# Altium project Phaser_DIOT.PrjPCB (part 1 of 10)
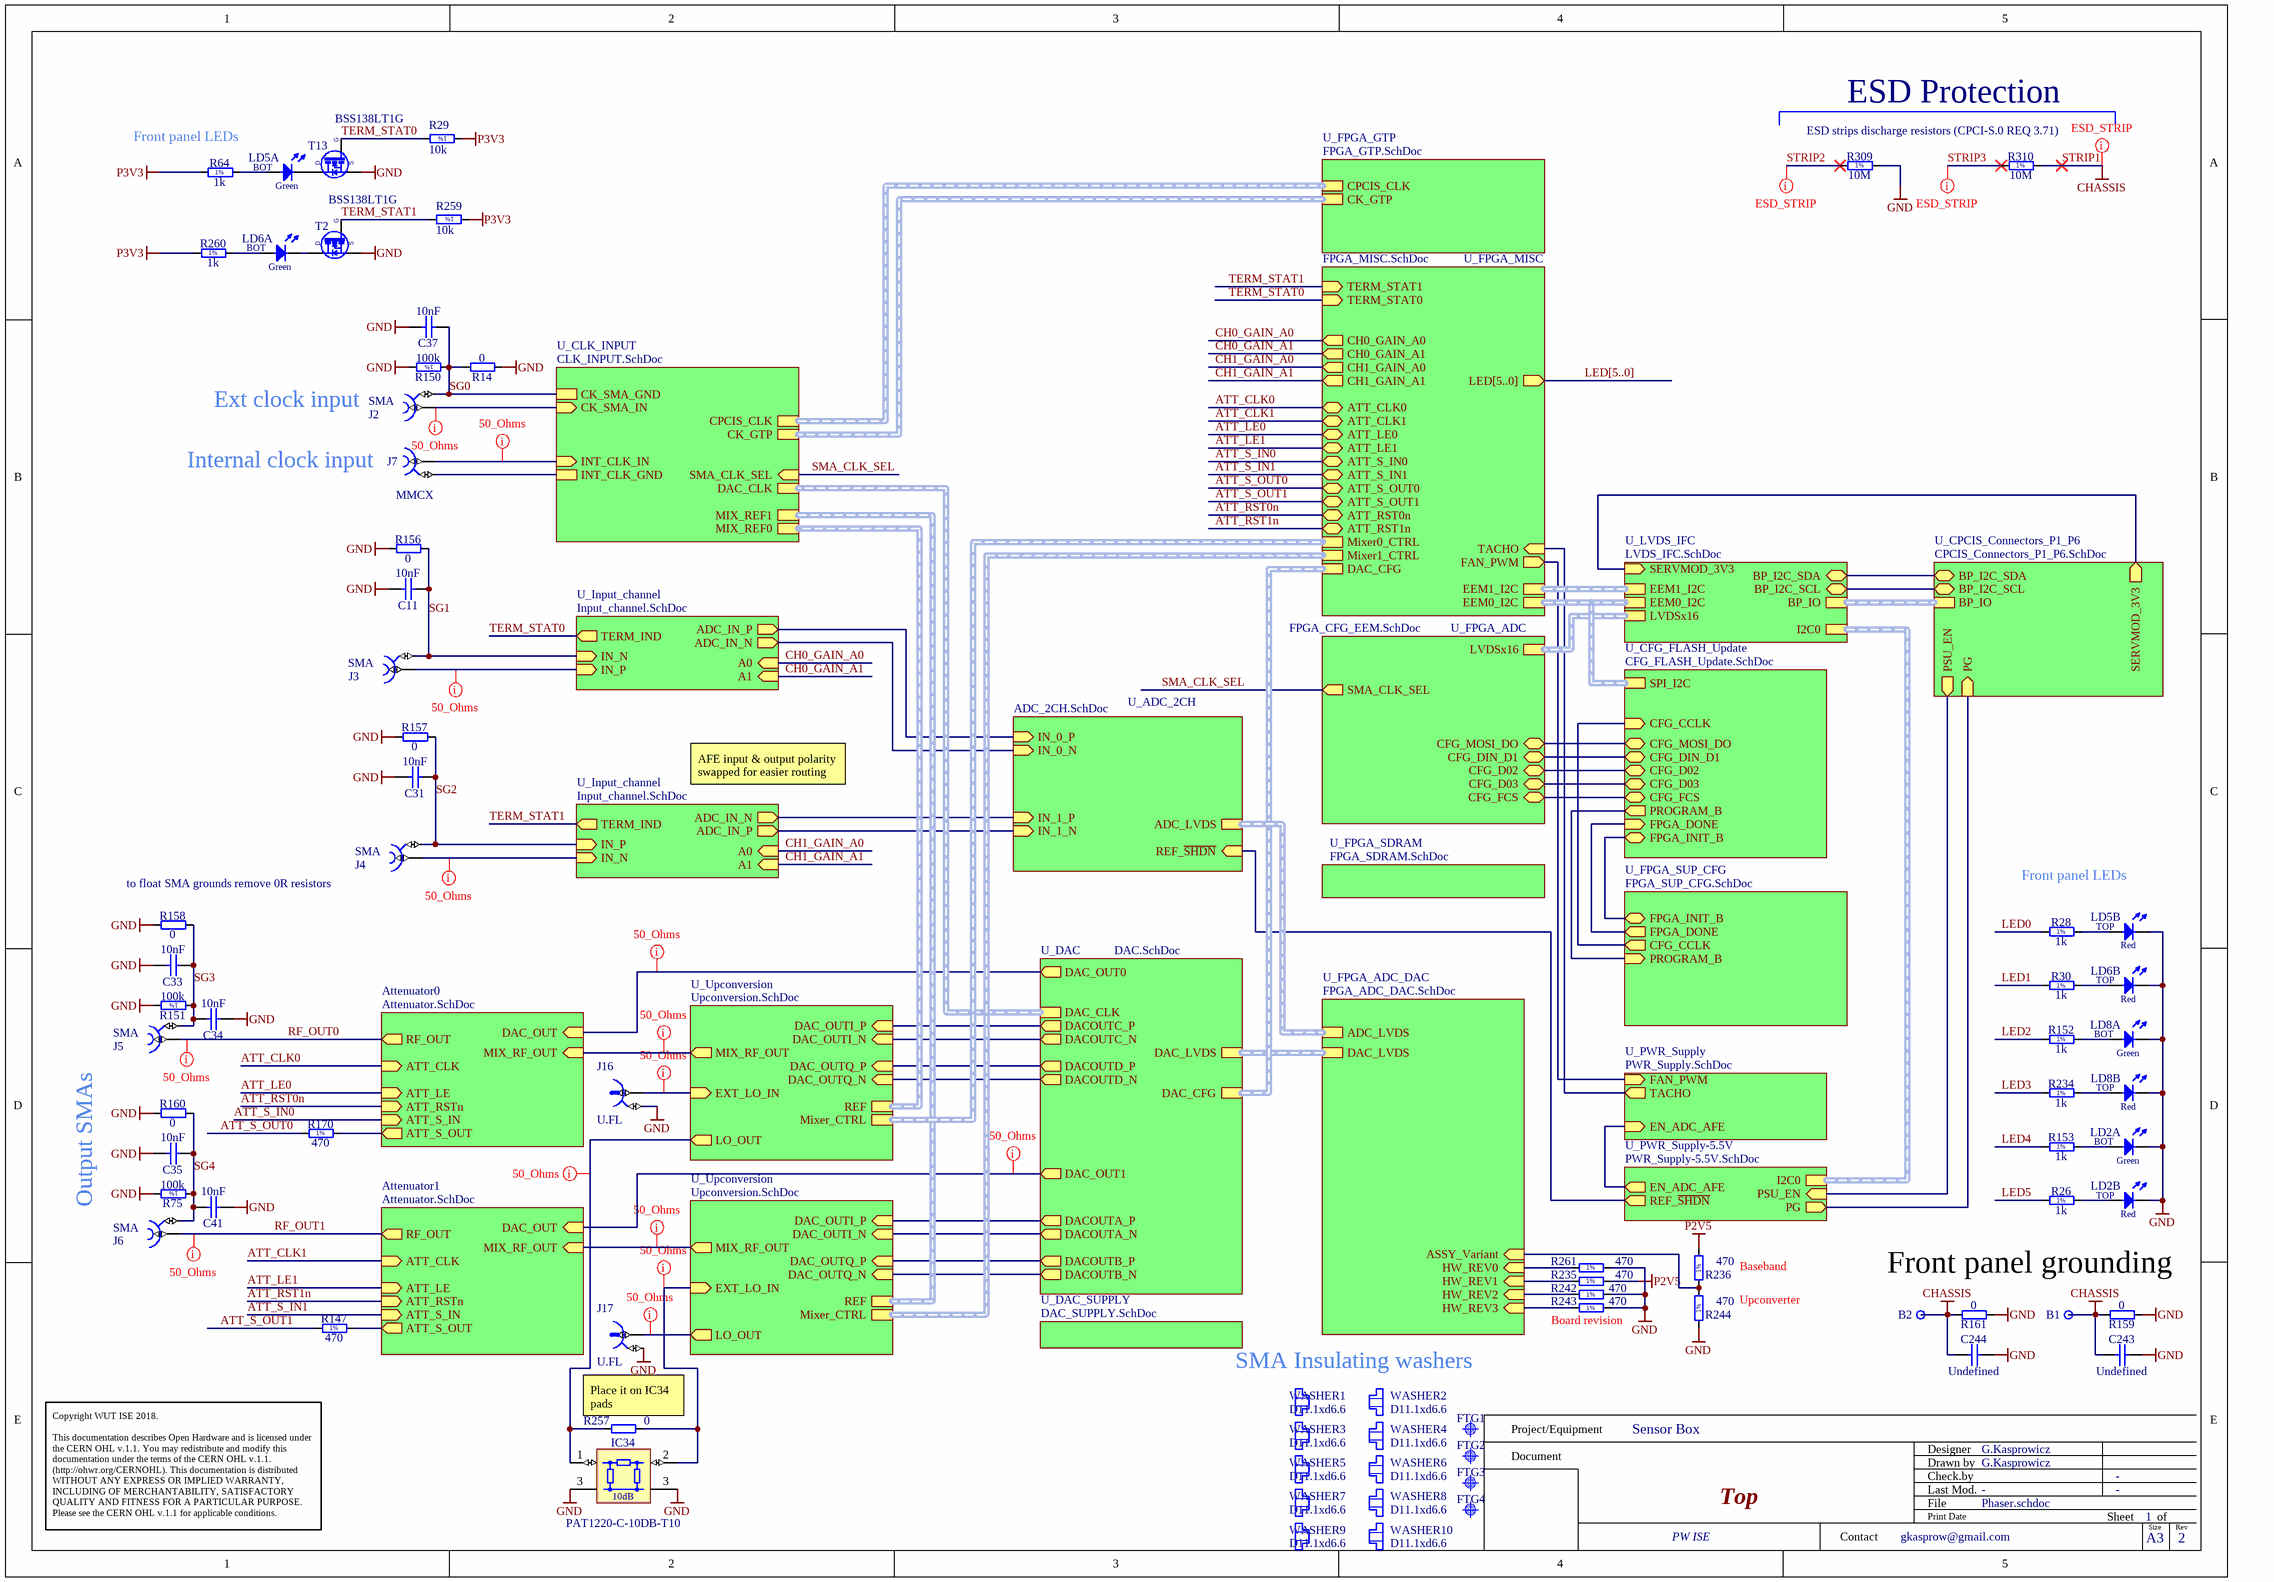
[diagram p0: Phaser.schdoc]
P_SheetTotal: 19; P_Title: Phaser_DIOT
19 sheets, 1099 parts. Net scope: hierarchical (ports join the sheet entries above them; power ports are global).
Board file: Phaser_DIOT.PcbDoc
Sheets:
  Phaser.schdoc
    Attenuator0 = Attenuator.SchDoc
    Attenuator1 = Attenuator.SchDoc
    U_FPGA_MISC = FPGA_MISC.SchDoc
    U_PWR_Supply = PWR_Supply.SchDoc
    U_CLK_INPUT = CLK_INPUT.SchDoc
    U_ADC_2CH = ADC_2CH.SchDoc
    U_Input_channel = Input_channel.SchDoc
    U_DAC = DAC.SchDoc
    U_FPGA_ADC = FPGA_CFG_EEM.SchDoc
    U_Input_channel = Input_channel.SchDoc
    U_FPGA_SUP_CFG = FPGA_SUP_CFG.SchDoc
    U_FPGA_GTP = FPGA_GTP.SchDoc
    U_FPGA_SDRAM = FPGA_SDRAM.SchDoc
    U_FPGA_ADC_DAC = FPGA_ADC_DAC.SchDoc
    U_CFG_FLASH_Update = CFG_FLASH_Update.SchDoc
    U_Upconversion = Upconversion.SchDoc
    U_Upconversion = Upconversion.SchDoc
    U_DAC_SUPPLY = DAC_SUPPLY.SchDoc
    U_LVDS_IFC = LVDS_IFC.SchDoc
    U_CPCIS_Connectors_P1_P6 = CPCIS_Connectors_P1_P6.SchDoc
    U_PWR_Supply-5.5V = PWR_Supply-5.5V.SchDoc

## Sheet Phaser.schdoc: =P_Title
size 420 x 297 mm; EDA_Number: ARTIQ; Projet: ARTIQ/SINARA; Author: G.Kasprowicz; CompanyName: WUT ISE; DrawnBy: G.Kasprowicz; Organization: WUT ISE; Address1: PW ISE; Address2: Nowowiejska 15/19 00-665 Warsaw; Address3: gkasprow@gmail.com; DocumentNumber: 1; Revision: 2; SheetNumber: 1; SheetTotal: 19; ModifiedBy: -; CheckedDate: -; Title2: Top; DivGrp: WUT ISE; Designer: G.Kasprowicz; ModifiedDate: -; ProjectName: Sensor Box

### Parts
B1  Plated Hole  [MTG270_500]  (value not drawn)
B2  Plated Hole  [MTG270_500]  (value not drawn)
C11  10nF  [CAPC1005X55N]
C31  10nF  [CAPC1005X55N]
C33  10nF  [CAPC1005X55N]
C34  10nF  [CAPC1005X55N]
C35  10nF  [CAPC1005X55N]
C37  10nF  [CAPC1005X55N]
C41  10nF  [CAPC1005X55N]
C243  Undefined  [CAPC2012X135N]
C244  Undefined  [CAPC2012X135N]
FTG1  Use only in PCB  [FIDUCIAL_TOP_C100-200]  (value not drawn)
FTG2  Use only in PCB  [FIDUCIAL_TOP_S100-200]  (value not drawn)
FTG3  Use only in PCB  [FIDUCIAL_TOP_S100-200]  (value not drawn)
FTG4  Use only in PCB  [FIDUCIAL_TOP_S100-200]  (value not drawn)
IC34  PAT1220-C-10DB-T10  [SUSUMU_PAT1220]
J2  SMA  [AMPHENOL_132203-14]
J3  SMA  [AMPHENOL_132203-14]
J4  SMA  [AMPHENOL_132203-14]
J5  SMA  [AMPHENOL_132203-14]
J6  SMA  [AMPHENOL_132203-14]
J7  MMCX  [SAMTEC_MMCX-J-P-H-ST-TH1]
J16  U.FL  [HIROSE_U.FL-R-SMT-1(10)]
J17  U.FL  [HIROSE_U.FL-R-SMT-1(10)]
LD2  Red/Green  [LED_DIALIGHT_571-0112F]  (value not drawn)  (parts A,B of 2)
LD5  Red/Green  [LED_DIALIGHT_571-0112F]  (value not drawn)  (parts A,B of 2)
LD6  Red/Green  [LED_DIALIGHT_571-0112F]  (value not drawn)  (parts A,B of 2)
LD8  Red/Green  [LED_DIALIGHT_571-0112F]  (value not drawn)  (parts A,B of 2)
R14  0  [RESC1608X55N]
R26  1k  [RESC1005X40N]
R28  1k  [RESC1005X40N]
R29  10k  [RESC1005X40N]
R30  1k  [RESC1005X40N]
R64  1k  [RESC1005X40N]
R75  100k  [RESC1005X40N]
R147  470  [RESC1005X40N]
R150  100k  [RESC1005X40N]
R151  100k  [RESC1005X40N]
R152  1k  [RESC1005X40N]
R153  1k  [RESC1005X40N]
R156  0  [RESC1608X55N]
R157  0  [RESC1608X55N]
R158  0  [RESC1608X55N]
R159  0  [RESC1608X55N]
R160  0  [RESC1608X55N]
R161  0  [RESC1608X55N]
R170  470  [RESC1005X40N]
R234  1k  [RESC1005X40N]
R235  470  [RESC1005X40N]
R236  470  [RESC1005X40N]
R242  470  [RESC1005X40N]
R243  470  [RESC1005X40N]
R244  470  [RESC1005X40N]
R257  0  [RESC1005X40N]
R259  10k  [RESC1005X40N]
R260  1k  [RESC1005X40N]
R261  470  [RESC1005X40N]
R309  10M  [RESC2113X55N]
R310  10M  [RESC2113X55N]
T2  BSS138LT1G  [SOT95P240X110-3N]
T13  BSS138LT1G  [SOT95P240X110-3N]
WASHER1  D11.1xd6.6  [Keystone_7687]
WASHER2  D11.1xd6.6  [Keystone_7687]
WASHER3  D11.1xd6.6  [Keystone_7687]
WASHER4  D11.1xd6.6  [Keystone_7687]
WASHER5  D11.1xd6.6  [Keystone_7687]
WASHER6  D11.1xd6.6  [Keystone_7687]
WASHER7  D11.1xd6.6  [Keystone_7687]
WASHER8  D11.1xd6.6  [Keystone_7687]
WASHER9  D11.1xd6.6  [Keystone_7687]
WASHER10  D11.1xd6.6  [Keystone_7687]

### Sub-sheets
Attenuator0 = Attenuator.SchDoc: RF_OUT (out), ATT_CLK (in), ATT_S_IN (in), ATT_LE (in), ATT_RSTn (in), ATT_S_OUT (out), DAC_OUT (in), MIX_RF_OUT (in)
Attenuator1 = Attenuator.SchDoc: RF_OUT (out), ATT_CLK (in), ATT_S_IN (in), ATT_LE (in), ATT_RSTn (in), ATT_S_OUT (out), DAC_OUT (in), MIX_RF_OUT (in)
U_ADC_2CH = ADC_2CH.SchDoc: REF_~{SHDN} (in), IN_0_P (in), IN_1_P (in), IN_0_N (in), IN_1_N (in), ADC_LVDS (harness ADC_LVDS)
U_CFG_FLASH_Update = CFG_FLASH_Update.SchDoc: SPI_I2C (harness I2C), CFG_MOSI_DO (bidir), CFG_DIN_D1 (bidir), CFG_D02 (bidir), CFG_D03 (bidir), CFG_FCS (bidir), CFG_CCLK (in), FPGA_DONE (in), FPGA_INIT_B (bidir), PROGRAM_B (out)
U_CLK_INPUT = CLK_INPUT.SchDoc: CK_SMA_IN (in), INT_CLK_IN (in), SMA_CLK_SEL (in), CK_GTP (harness CLKDIFF), MIX_REF0 (harness CLKDIFF), MIX_REF1 (harness CLKDIFF), DAC_CLK (harness CLKDIFF), CK_SMA_GND, INT_CLK_GND, CPCIS_CLK (harness CLKDIFF)
U_CPCIS_Connectors_P1_P6 = CPCIS_Connectors_P1_P6.SchDoc: SERVMOD_3V3 (out), PSU_EN (out), BP_I2C_SDA (bidir), BP_I2C_SCL (bidir), BP_IO (harness BP_IO), PG (in)
U_DAC = DAC.SchDoc: DAC_CFG (harness DAC_CFG), DAC_LVDS (harness DAC_LVDS), DAC_CLK (harness CLKDIFF), DAC_OUT0 (out), DAC_OUT1 (out), DACOUTD_P (out), DACOUTD_N (out), DACOUTC_N (out), DACOUTC_P (out), DACOUTA_P (out), DACOUTA_N (out), DACOUTB_N (out), DACOUTB_P (out)
U_DAC_SUPPLY = DAC_SUPPLY.SchDoc: no entries
U_FPGA_ADC = FPGA_CFG_EEM.SchDoc: CFG_DIN_D1 (bidir), CFG_FCS (bidir), CFG_MOSI_DO (bidir), CFG_D02 (bidir), CFG_D03 (bidir), SMA_CLK_SEL (out), LVDSx16
U_FPGA_ADC_DAC = FPGA_ADC_DAC.SchDoc: DAC_LVDS (harness DAC_LVDS), ADC_LVDS, ASSY_Variant (in), HW_REV1 (in), HW_REV2 (in), HW_REV0 (in), HW_REV3 (in)
U_FPGA_GTP = FPGA_GTP.SchDoc: CK_GTP (harness CLKDIFF), CPCIS_CLK
U_FPGA_MISC = FPGA_MISC.SchDoc: DAC_CFG (harness DAC_CFG), LED[5..0] (out), EEM1_I2C (harness I2C), EEM0_I2C (harness I2C), Mixer1_CTRL (harness Mixer_CTRL), Mixer0_CTRL (harness Mixer_CTRL), CH0_GAIN_A0 (out), CH0_GAIN_A1 (out), CH1_GAIN_A0 (out), CH1_GAIN_A1 (out), ATT_CLK0 (bidir), ATT_CLK1 (bidir), ATT_LE0 (bidir), ATT_LE1 (bidir), ATT_S_IN0 (bidir), ATT_S_OUT0 (bidir), ATT_S_IN1 (bidir), ATT_S_OUT1 (bidir), ATT_RST0n (bidir), ATT_RST1n (bidir), FAN_PWM (out), TERM_STAT1 (in), TERM_STAT0 (in), TACHO (in)
U_FPGA_SDRAM = FPGA_SDRAM.SchDoc: no entries
U_FPGA_SUP_CFG = FPGA_SUP_CFG.SchDoc: FPGA_INIT_B (bidir), FPGA_DONE (out), CFG_CCLK (out), PROGRAM_B (in)
U_Input_channel = Input_channel.SchDoc: IN_N (in), A0 (in), A1 (in), IN_P (in), ADC_IN_P (out), ADC_IN_N (out), TERM_IND (out)
U_Input_channel = Input_channel.SchDoc: IN_N (in), A0 (in), A1 (in), IN_P (in), ADC_IN_P (out), ADC_IN_N (out), TERM_IND (out)
U_LVDS_IFC = LVDS_IFC.SchDoc: I2C0 (harness I2C), EEM0_I2C (harness I2C), EEM1_I2C (harness I2C), LVDSx16 (harness LVDSx16), BP_IO (harness BP_IO), BP_I2C_SDA (bidir), BP_I2C_SCL (bidir), SERVMOD_3V3 (in)
U_PWR_Supply = PWR_Supply.SchDoc: EN_ADC_AFE (in), FAN_PWM (in), TACHO (out)
U_PWR_Supply-5.5V = PWR_Supply-5.5V.SchDoc: I2C0 (harness I2C), EN_ADC_AFE (out), REF_~{SHDN} (out), PSU_EN (in), PG (out)
U_Upconversion = Upconversion.SchDoc: DAC_OUTI_P (in), DAC_OUTI_N (in), DAC_OUTQ_N (in), DAC_OUTQ_P (in), REF (harness CLKDIFF), MIX_RF_OUT (out), Mixer_CTRL (harness Mixer_CTRL), EXT_LO_IN (in), LO_OUT (out)
U_Upconversion = Upconversion.SchDoc: DAC_OUTI_P (in), DAC_OUTI_N (in), DAC_OUTQ_N (in), DAC_OUTQ_P (in), REF (harness CLKDIFF), Mixer_CTRL (harness Mixer_CTRL), MIX_RF_OUT (out), EXT_LO_IN (in), LO_OUT (out)

### Nets
GND: C11.2 C31.2 C33.2 C34.1 C35.2 C37.2 C41.1 C243.2 C244.2 IC34.3(GND) J16.2 J17.2 LD2.1(C) LD2.3(C) LD5.3(C) LD6.3(C) LD8.1(C) LD8.3(C) R14.1 R75.1 R150.1 R151.1 R156.1 R157.1 R158.1 R159.1 R160.1 R161.1 R242.2 R243.2 R244.1 R261.2 R309.2 T2.2(S) T13.2(S)
P2V5: R235.2 R236.2
P3V3: R29.1 R64.1 R259.1 R260.1
STRIP1: B1.1 B2.1 C243.1 C244.1 R159.2 R161.2 R310.2  [also labelled CHASSIS]
ASSY_Variant: R236.1 R244.2 ; sheet U_FPGA_ADC_DAC/ASSY_Variant
ATT_CLK0: sheet Attenuator0/ATT_CLK, sheet U_FPGA_MISC/ATT_CLK0
ATT_CLK1: sheet Attenuator1/ATT_CLK, sheet U_FPGA_MISC/ATT_CLK1
ATT_LE0: sheet Attenuator0/ATT_LE, sheet U_FPGA_MISC/ATT_LE0
ATT_LE1: sheet Attenuator1/ATT_LE, sheet U_FPGA_MISC/ATT_LE1
ATT_RST0n: sheet Attenuator0/ATT_RSTn, sheet U_FPGA_MISC/ATT_RST0n
ATT_RST1n: sheet Attenuator1/ATT_RSTn, sheet U_FPGA_MISC/ATT_RST1n
ATT_S_IN0: sheet Attenuator0/ATT_S_IN, sheet U_FPGA_MISC/ATT_S_IN0
ATT_S_IN1: sheet Attenuator1/ATT_S_IN, sheet U_FPGA_MISC/ATT_S_IN1
ATT_S_OUT0: R170.1 ; sheet U_FPGA_MISC/ATT_S_OUT0
ATT_S_OUT1: R147.1 ; sheet U_FPGA_MISC/ATT_S_OUT1
BBI_N: sheet U_DAC/DACOUTA_N, sheet U_Upconversion/DAC_OUTI_N
BBI_N: sheet U_DAC/DACOUTC_N, sheet U_Upconversion/DAC_OUTI_N  [a separate net that carries the same name]
BBI_P: sheet U_DAC/DACOUTA_P, sheet U_Upconversion/DAC_OUTI_P
BBI_P: sheet U_DAC/DACOUTC_P, sheet U_Upconversion/DAC_OUTI_P  [a separate net that carries the same name]
BBQ_N: sheet U_DAC/DACOUTB_N, sheet U_Upconversion/DAC_OUTQ_N
BBQ_N: sheet U_DAC/DACOUTD_N, sheet U_Upconversion/DAC_OUTQ_N  [a separate net that carries the same name]
BBQ_P: sheet U_DAC/DACOUTB_P, sheet U_Upconversion/DAC_OUTQ_P
BBQ_P: sheet U_DAC/DACOUTD_P, sheet U_Upconversion/DAC_OUTQ_P  [a separate net that carries the same name]
BP_I2C_SCL: sheet U_LVDS_IFC/BP_I2C_SCL, sheet U_CPCIS_Connectors_P1_P6/BP_I2C_SCL
BP_I2C_SDA: sheet U_LVDS_IFC/BP_I2C_SDA, sheet U_CPCIS_Connectors_P1_P6/BP_I2C_SDA
CFG_CCLK: sheet U_FPGA_SUP_CFG/CFG_CCLK, sheet U_CFG_FLASH_Update/CFG_CCLK
CFG_D02: sheet U_FPGA_ADC/CFG_D02, sheet U_CFG_FLASH_Update/CFG_D02
CFG_D03: sheet U_FPGA_ADC/CFG_D03, sheet U_CFG_FLASH_Update/CFG_D03
CFG_DIN: sheet U_FPGA_ADC/CFG_DIN_D1, sheet U_CFG_FLASH_Update/CFG_DIN_D1
CFG_FCS: sheet U_FPGA_ADC/CFG_FCS, sheet U_CFG_FLASH_Update/CFG_FCS
CFG_MOSI: sheet U_FPGA_ADC/CFG_MOSI_DO, sheet U_CFG_FLASH_Update/CFG_MOSI_DO
CH0_GAIN_A0: sheet U_FPGA_MISC/CH0_GAIN_A0, sheet U_Input_channel/A0
CH0_GAIN_A1: sheet U_FPGA_MISC/CH0_GAIN_A1, sheet U_Input_channel/A1
CH1_GAIN_A0: sheet U_FPGA_MISC/CH1_GAIN_A0, sheet U_Input_channel/A0
CH1_GAIN_A1: sheet U_FPGA_MISC/CH1_GAIN_A1, sheet U_Input_channel/A1
FAN_PWM: sheet U_FPGA_MISC/FAN_PWM, sheet U_PWR_Supply/FAN_PWM
FAN_TACHO: sheet U_FPGA_MISC/TACHO, sheet U_PWR_Supply/TACHO
FPGA_DONE: sheet U_FPGA_SUP_CFG/FPGA_DONE, sheet U_CFG_FLASH_Update/FPGA_DONE
FPGA_INIT_B: sheet U_FPGA_SUP_CFG/FPGA_INIT_B, sheet U_CFG_FLASH_Update/FPGA_INIT_B
FPGA_PROGRAM_B: sheet U_FPGA_SUP_CFG/PROGRAM_B, sheet U_CFG_FLASH_Update/PROGRAM_B
HW_REV0: R261.1 ; sheet U_FPGA_ADC_DAC/HW_REV0
HW_REV1: R235.1 ; sheet U_FPGA_ADC_DAC/HW_REV1
HW_REV2: R242.1 ; sheet U_FPGA_ADC_DAC/HW_REV2
HW_REV3: R243.1 ; sheet U_FPGA_ADC_DAC/HW_REV3
IN_0_N: sheet U_ADC_2CH/IN_0_N, sheet U_Input_channel/ADC_IN_N
IN_0_P: sheet U_ADC_2CH/IN_0_P, sheet U_Input_channel/ADC_IN_P
IN_1_N: sheet U_ADC_2CH/IN_1_N, sheet U_Input_channel/ADC_IN_P
IN_1_P: sheet U_ADC_2CH/IN_1_P, sheet U_Input_channel/ADC_IN_N
LED0: R28.1
LED1: R30.1
LED2: R152.1
LED3: R234.1
LED4: R153.1
LED5: R26.1
PG: sheet U_CPCIS_Connectors_P1_P6/PG, sheet U_PWR_Supply-5.5V/PG
PSU_EN: sheet U_CPCIS_Connectors_P1_P6/PSU_EN, sheet U_PWR_Supply-5.5V/PSU_EN
RF_OUT0: J5.1 ; sheet Attenuator0/RF_OUT
RF_OUT1: J6.1 ; sheet Attenuator1/RF_OUT
SERVMOD_3V3: sheet U_LVDS_IFC/SERVMOD_3V3, sheet U_CPCIS_Connectors_P1_P6/SERVMOD_3V3
SG0: C37.1 J2.2 R14.2 R150.2 ; sheet U_CLK_INPUT/CK_SMA_GND
SG1: C11.1 J3.2 R156.2 ; sheet U_Input_channel/IN_N
SG2: C31.1 J4.2 R157.2 ; sheet U_Input_channel/IN_P
SG3: C33.1 C34.2 J5.2 R151.2 R158.2
SG4: C35.1 C41.2 J6.2 R75.2 R160.2
SMA_CLK_SEL: sheet U_CLK_INPUT/SMA_CLK_SEL, sheet U_FPGA_ADC/SMA_CLK_SEL
STRIP2: R309.1
STRIP3: R310.1
TERM_STAT0: R29.2 T13.1(G) ; sheet U_FPGA_MISC/TERM_STAT0, sheet U_Input_channel/TERM_IND
TERM_STAT1: R259.2 T2.1(G) ; sheet U_FPGA_MISC/TERM_STAT1, sheet U_Input_channel/TERM_IND
NetC133A_1: J16.1 ; sheet U_Upconversion/EXT_LO_IN
NetC133B_1: IC34.2(OUT) R257.1 ; sheet U_Upconversion/EXT_LO_IN
NetC190_1: J7.1 ; sheet U_CLK_INPUT/INT_CLK_IN
NetC196_1: J2.1 ; sheet U_CLK_INPUT/CK_SMA_IN
NetC270A_2: sheet Attenuator0/DAC_OUT, sheet U_DAC/DAC_OUT0
NetC270B_2: sheet Attenuator1/DAC_OUT, sheet U_DAC/DAC_OUT1
NetC354A_1: IC34.1(IN) R257.2 ; sheet U_Upconversion/LO_OUT
NetC354B_1: J17.1 ; sheet U_Upconversion/LO_OUT
NetC369A_1: sheet Attenuator0/MIX_RF_OUT, sheet U_Upconversion/MIX_RF_OUT
NetC369B_1: sheet Attenuator1/MIX_RF_OUT, sheet U_Upconversion/MIX_RF_OUT
NetIC3A_19: R170.2 ; sheet Attenuator0/ATT_S_OUT
NetIC3B_19: R147.2 ; sheet Attenuator1/ATT_S_OUT
NetIC7_3: sheet U_PWR_Supply/EN_ADC_AFE, sheet U_PWR_Supply-5.5V/EN_ADC_AFE
NetJ3_1: J3.1 ; sheet U_Input_channel/IN_P
NetJ4_1: J4.1 ; sheet U_Input_channel/IN_N
NetJ7_2: J7.2 ; sheet U_CLK_INPUT/INT_CLK_GND
NetLD2_2: LD2.2(A) R153.2
NetLD2_4: LD2.4(A) R26.2
NetLD5_1: LD5.1(C) T13.3(D)
NetLD5_2: LD5.2(A) R64.2
NetLD5_4: LD5.4(A) R28.2
NetLD6_1: LD6.1(C) T2.3(D)
NetLD6_2: LD6.2(A) R260.2
NetLD6_4: LD6.4(A) R30.2
NetLD8_2: LD8.2(A) R152.2
NetLD8_4: LD8.4(A) R234.2
NetR60_2: sheet U_ADC_2CH/REF_~{SHDN}, sheet U_PWR_Supply-5.5V/REF_~{SHDN}

### Buses and harness runs
bus LED[5..0] = sheet U_FPGA_MISC/LED[5..0]
harness sheet U_ADC_2CH/ADC_LVDS = sheet U_FPGA_ADC_DAC/ADC_LVDS
harness sheet U_CFG_FLASH_Update/SPI_I2C = sheet U_FPGA_MISC/EEM0_I2C = sheet U_LVDS_IFC/EEM0_I2C
harness sheet U_CLK_INPUT/CK_GTP = sheet U_FPGA_GTP/CK_GTP
harness sheet U_CLK_INPUT/CPCIS_CLK = sheet U_FPGA_GTP/CPCIS_CLK
harness sheet U_CLK_INPUT/DAC_CLK = sheet U_DAC/DAC_CLK
harness sheet U_CLK_INPUT/MIX_REF0 = sheet U_Upconversion/REF
harness sheet U_CLK_INPUT/MIX_REF1 = sheet U_Upconversion/REF
harness sheet U_CPCIS_Connectors_P1_P6/BP_IO = sheet U_LVDS_IFC/BP_IO
harness sheet U_DAC/DAC_CFG = sheet U_FPGA_MISC/DAC_CFG
harness sheet U_DAC/DAC_LVDS = sheet U_FPGA_ADC_DAC/DAC_LVDS
harness sheet U_FPGA_ADC/LVDSx16 = sheet U_LVDS_IFC/LVDSx16
harness sheet U_FPGA_MISC/EEM1_I2C = sheet U_LVDS_IFC/EEM1_I2C
harness sheet U_FPGA_MISC/Mixer0_CTRL = sheet U_Upconversion/Mixer_CTRL
harness sheet U_FPGA_MISC/Mixer1_CTRL = sheet U_Upconversion/Mixer_CTRL
harness sheet U_LVDS_IFC/I2C0 = sheet U_PWR_Supply-5.5V/I2C0

### Layout directives
net class 50_Ohms: NetC133A_1, NetC133B_1, NetC190_1, NetC196_1, NetC270A_2, NetC270B_2, NetC354A_1, NetC354B_1, NetC369A_1, NetC369B_1, NetJ3_1, NetJ4_1, RF_OUT0, RF_OUT1
net class ESD_STRIP: STRIP1, STRIP2, STRIP3

### Notes on the sheet
- ESD Protection
- Front panel LEDs
- ESD strips discharge resistors (CPCI-S.0 REQ 3.71)
- (near J2) Ext clock input
- (near J7) Internal clock input
- AFE input & output polarity swapped for easier routing
- to float SMA grounds remove 0R resistors
- Output SMAs
- (near R243) Board revision
- Baseband
- Upconverter
- Front panel grounding
- SMA Insulating washers
- (near R257) Place it on IC34 pads
- Project/Equipment
- Document
- Designer
- Drawn by
- Check.by
- Copyright WUT ISE 2018.
  This documentation describes Open Hardware and is licensed under the CERN OHL v.1.1. You may redistribute and modify this documentation under the terms of the CERN OHL v.1.1. (http://ohwr.org/CERNOHL). This documentation is distributed WITHOUT ANY EXPRESS OR IMPLIED WARRANTY, INCLUDING OF MERCHANTABILITY, SATISFACTORY QUALITY AND FITNESS FOR A PARTICULAR PURPOSE. Please see the CERN OHL v.1.1 for applicable conditions.
- Contact
- File
- Last Mod.
- Print Date
- Sheet
- Size
- A3
- of
- Rev
- (in symbol LED_DIALIGHT_571-0112F, part A) BOT; Green
- (in symbol LED_DIALIGHT_571-0112F, part B) TOP; Red
- (in symbol PAT1220-C-10DB-T10) 10dB
- (in symbol R0402_1K_1%_0.0625W_100PPM) 1%
- (in symbol R0402_10K_1%_0.0625W_100PPM) 1%
- (in symbol R0402_100K_1%_0.0625W_100PPM) 1%
- (in symbol R0402_470R_1%_0.0625W_100PPM) 1%
- (in symbol R0805_10M_1%_0.125W_100PPM_VISHAY_CRCW e3) 1%

### Library data of the parts
B1 B2 = PLATED_HOLE2.7_PAD5.0: Single Terminal Socket; Part Description: Plated Through Hole: Hole Dia.=2.7mm Pad Dia.=5.0mm; Mounted: No; Part Number: PLATED_HOLE2.7_PAD5.0; Component Kind: Standard (No BOM); Component Type: Standard (No BOM); Pin Count: 1; Family: Plated Hole; Socket: No; SMD: No; Sense: No; Status: None; ComponentHeight: 0mm; HelpURL: Undefined; Author: CERN DEM JMW; CreateDate: 27.09.2011; LatestRevisionDate: 27.09.2011; PackageDescription: Plated Through Hole: Hole Dia.=2.7mm Pad Dia.=5.0mm
C11 C31 C33-C35 C37 C41 = CC0402_10NF_16V_10%_X7R: Non-polarised capacitor; Part Description: SMD Multilayer Chip Ceramic Capacitor; Manufacturer: GENERIC; Manufacturer1 Part Number: 223878715636; Voltage: 16V; TC: X7R; Tolerance: ±10%; Part Number: CC0402_10NF_16V_10%_X7R; Component Kind: Standard; Component Type: Standard; Pin Count: 2; Value: 10nF; Status: Not Recommended; Manufacturer Part Number: CC0402_10NF_16V_10%_X7R; Case: 0402; Mounted: Yes; Socket: No; SMD: Yes; Sense: No; Manufacturer1 Example: PHYCOMP; Manufacturer1 ComponentHeight: 0.55mm; HelpURL: \\cern.ch\dfs\Applications\Altium\Datasheets\CC0402_X7R_PHYCOMP.pdf; Author: CERN DEM JLC; CreateDate: 2007-12-03; LatestRevisionDate: 2007-12-03
C243 C244 = CC0805_NO-VALUE: Non-polarised capacitor; Part Description: Reserved Footprint For 0805(2012) Chip Ceramic Capacitor; Mounted: No; Part Number: CC0805_NO-VALUE; Component Kind: Standard; Component Type: Standard; Pin Count: 2; Value: Undefined; Status: None; Manufacturer: Undefined; Manufacturer Part Number: CC0805_NO-VALUE; Case: 0805; Socket: No; SMD: Yes; Sense: No; Manufacturer1 ComponentHeight: 1.35mm; HelpURL: Undefined; Author: CERN DEM JLC; CreateDate: 10.12.2008; LatestRevisionDate: 11.09.2013
FTG1 = FIDUCIAL_TARGET_C100-200: Fiducial Target; Part Description: Round Fiducial Target, Top Layer, 1.0mm, Top Solder 2.0mm, Keepout =2.0mm; Mounted: No; Part Number: FIDUCIAL_TARGET_C100-200; Component Kind: Standard (No BOM); Component Type: Standard (No BOM); Pin Count: 1; Family: Fiducial; Socket: No; SMD: Yes; Sense: No; Status: None; ComponentHeight: 0mm; HelpURL: Undefined; Author: CERN DEM JLC; CreateDate: 09.02.2010; LatestRevisionDate: 04.04.2012; PackageDescription: Round Fiducial Target, Top Layer, 1.0mm, Top Solder 2.0mm, Keepout =2.0mm
FTG2-FTG4 = FIDUCIAL_TARGET_S100-200: Fiducial Target; Part Description: Square Fiducial Target, Top Layer, 1.0mm, Top Solder 2.0mm, Keepout =2.0mm; Mounted: No; Part Number: FIDUCIAL_TARGET_S100-200; Component Kind: Standard (No BOM); Component Type: Standard (No BOM); Pin Count: 1; Family: Fiducial; Socket: No; SMD: Yes; Sense: No; Status: None; ComponentHeight: 0mm; HelpURL: Undefined; Author: CERN DEM JLC; CreateDate: 09.02.2010; LatestRevisionDate: 04.04.2012; PackageDescription: Square Fiducial Target, Top Layer, 1.0mm, Top Solder 2.0mm, Keepout =2.0mm
IC34 = PAT1220-C-10DB-T10: DC to 10GHz, 100mW, 50 Ohm, 10dB, Precision Chip Attenuator; Manufacturer: SUSUMU; PressFit: No; Bonding: No; Part Number: PAT1220-C-10DB-T10; Component Kind: Standard; Component Type: Standard; Device: PAT1220-C-10DB-T10; PackageDescription: SUSUMU PAT1220, 4 Pin Attenuator, Size 0805, L 2.00 x W 1.25 H 0.5mm; Part Description: DC to 10GHz, 100mW, 50 Ohm, 10dB, Precision Chip Attenuator; Manufacturer Part Number: PAT1220-C-10DB-T10; Pin Count: 4; Mounted: Yes; Socket: No; SMD: Yes; Sense: No; ComponentHeight: 0.5mm; Author: CERN DEM MR; HelpURL: \\cern.ch\dfs\Applications\Altium\Datasheets\PAT1220-C-10DB-T10.pdf; CreateDate: 04.10.2017; LatestRevisionDate: 04.10.2017
J2-J6 = CON_SMA_AMP_132203-14: 50 Ohm Through Hole SMA Right Angle PCB Jack; Manufacturer: AMPHENOL; PressFit: No; Part Number: AMPHENOL_132203-14; Component Kind: Standard; Component Type: Standard; Pin Count: 5; Family: SMA; Mounted: Yes; Socket: No; SMD: No; Sense: No; Status: None; Part Description: 50 Ohm Through Hole SMA Right Angle PCB Jack; Manufacturer Part Number: 132203-14; ComponentHeight: 10.4mm; HelpURL: \\cern.ch\dfs\Applications\Altium\Datasheets\AMPHENOL_132203-16.pdf; Author: GK; CreateDate: 13.05.2019; LatestRevisionDate: 13.05.2019
J7 = SAMTEC_MMCX-J-P-H-ST-TH1: Part Description: Straight Through-hole 50 Ohm Micro Mini RF Jack, MMCX Series; Manufacturer: SAMTEC; PressFit: No; Part Number: SAMTEC_MMCX-J-P-H-ST-TH1; Component Kind: Standard; Component Type: Standard; Pin Count: 2; Mounted: Yes; Socket: No; Sense: No; SMD: No; Status: None; Manufacturer Part Number: MMCX-J-P-H-ST-TH1; ComponentHeight: 4.35mm; HelpURL: \\cern.ch\dfs\Applications\Altium\Datasheets\SAMTEC_MMCX-J-P-H-ST-TH1.pdf; Author: CERN DEM JLC; CreateDate: 05.12.2012; LatestRevisionDate: 05.12.2012
J16 J17 = HIROSE_U.FL-R-SMT-1(10): Part Description: Up to 6GHz Ultra Small Surface Mount Male Coaxial Connectors U.FL Series; Manufacturer: HIROSE (HRS); PressFit: No; Component Kind: Standard; Component Type: Standard; Pin Count: 2; Mounted: Yes; Socket: No; Sense: No; SMD: Yes; Status: None; Manufacturer Part Number: U.FL-R-SMT-1(10); ComponentHeight: 1.25mm; HelpURL: \\cern.ch\dfs\Applications\Altium\Datasheets\HIROSE_U.FL-R-SMT-1(10).pdf; Author: CERN DEM JLC; CreateDate: 24.03.2010; LatestRevisionDate: 24.03.2010; Part Number: HIROSE_U.FL-R-SMT-1(10); Family: U.FL
LD2 LD5 LD6 LD8 = LED_DIALIGHT_571-0112F: 2x LED  Botom Green, Top Red; Part Description: Dual 2mm  LEDs, Red Top,Green Bot, CBI® Circuit Board Indicator (Without positioning pins); PressFit: No; Bonding: No; Part Number: LED_DIALIGHT_571-0112F; Component Kind: Standard; Component Type: Standard; Color: Red/Green; PackageDescription: 2x 2mm LED (Top: Red, Bot: Green) PCB Edge Mounting (Without positioning pins) DIALIGHT 571 Serie; Manufacturer: DIALIGHT; Manufacturer Part Number: 571-0112F; Pin Count: 4; Mounted: Yes; Socket: No; SMD: No; Sense: No; ComponentHeight: 8.6mm; HelpURL: \\cern.ch\dfs\Applications\Altium\Datasheets\LED_DIALIGHT_571-0112F.pdf; Author: CERN DEM JLC; CreateDate: 09.11.2009; LatestRevisionDate: 17.03.2010
R14 R156-R161 = R0603_0R_JUMPER: Resistor; Part Description: 1A (0.05R Max DC Resistance) Zero Ohm Jumper; Manufacturer: GENERIC; Manufacturer1 Part Number: NRC06Z0; PressFit: No; Part Number: R0603_0R_JUMPER; Component Kind: Standard; Component Type: Standard; Pin Count: 2; Value: 0; Status: Preferred; Manufacturer Part Number: R0603_0R_JUMPER; Case: 0603; Mounted: Yes; Sense: No; Socket: No; SMD: Yes; Manufacturer1 Example: NIC COMPONENT; Manufacturer1 ComponentHeight: 0.55mm; HelpURL: \\cern.ch\dfs\Applications\Altium\Datasheets\R0603_NIC_NRC.pdf; Author: CERN DEM JLC; CreateDate: 03.12.2007; LatestRevisionDate: 13.03.2008
R26 R28 R30 R64 R152 R153 R234 R260 = R0402_1K_1%_0.0625W_100PPM: Resistor - 1%; Part Description: General Purpose Thick Film Chip Resistor; Manufacturer: GENERIC; Manufacturer1 Part Number: 232270671002L; TC: ±100ppm/°C; PressFit: No; Part Number: R0402_1K_1%_0.0625W_100PPM; Component Kind: Standard; Component Type: Standard; Pin Count: 2; Value: 1k; Status: Not Recommended; Power: 0.0625W; Tolerance: ±1%; Manufacturer Part Number: R0402_1K_1%_0.0625W_100PPM; Case: 0402; Mounted: Yes; Sense: No; Socket: No; SMD: Yes; Manufacturer1 Example: YAGEO PHYCOMP; Manufacturer1 ComponentHeight: 0.4mm; HelpURL: \\cern.ch\dfs\Applications\Altium\Datasheets\R0402_Phycomp_RC0402.pdf; Author: CERN DEM JLC; CreateDate: 03.12.2007; LatestRevisionDate: 17.10.2012
R29 R259 = R0402_10K_1%_0.0625W_100PPM: Resistor - 1%; Part Description: General Purpose Thick Film Chip Resistor; Manufacturer: GENERIC; Manufacturer1 Part Number: 232270671003L; TC: ±100ppm/°C; Part Number: R0402_10K_1%_0.0625W_100PPM; Component Kind: Standard; Component Type: Standard; Pin Count: 2; Value: 10k; Status: Not recommended; Power: 0.0625W; Tolerance: ±1%; Manufacturer Part Number: R0402_10K_1%_0.0625W_100PPM; Case: 0402; Mounted: Yes; Sense: No; Socket: No; SMD: Yes; Manufacturer1 Example: YAGEO PHYCOMP; Manufacturer1 ComponentHeight: 0.4mm; HelpURL: \\cern.ch\dfs\Applications\Altium\Datasheets\R0402_Phycomp_RC0402.pdf; Author: CERN DEM JLC; CreateDate: 03.12.2007; LatestRevisionDate: 17.10.2012
R75 R150 R151 = R0402_100K_1%_0.0625W_100PPM: Resistor - 1%; Part Description: General Purpose Thick Film Chip Resistor; Manufacturer: GENERIC; Manufacturer1 Part Number: 232270671004L; PressFit: No; TC: ±100ppm/°C; Part Number: R0402_100K_1%_0.0625W_100PPM; Component Kind: Standard; Component Type: Standard; Pin Count: 2; Value: 100k; Status: Not Recommended; Manufacturer Part Number: R0402_100K_1%_0.0625W_100PPM; Case: 0402; Mounted: Yes; Sense: No; Socket: No; SMD: Yes; Manufacturer1 Example: YAGEO PHYCOMP; Manufacturer1 ComponentHeight: 0.4mm; HelpURL: \\cern.ch\dfs\Applications\Altium\Datasheets\R0402_Phycomp_RC0402.pdf; Author: CERN DEM JLC; CreateDate: 03.12.2007; LatestRevisionDate: 17.10.2012; Power: 0.0625W; Tolerance: ±1%
R147 R170 R235 R236 R242-R244 R261 = R0402_470R_1%_0.0625W_100PPM: Resistor - 1%; Part Description: General Purpose Thick Film Chip Resistor; Manufacturer: GENERIC; Manufacturer1 Part Number: 232270674701L; TC: ±100ppm/°C; PressFit: No; Part Number: R0402_470R_1%_0.0625W_100PPM; Component Kind: Standard; Component Type: Standard; Pin Count: 2; Value: 470; Status: Not Recommended; Power: 0.0625W; Tolerance: ±1%; Manufacturer Part Number: R0402_470R_1%_0.0625W_100PPM; Case: 0402; Mounted: Yes; Sense: No; Socket: No; SMD: Yes; Manufacturer1 Example: YAGEO PHYCOMP; Manufacturer1 ComponentHeight: 0.4mm; HelpURL: \\cern.ch\dfs\Applications\Altium\Datasheets\R0402_Phycomp_RC0402.pdf; Author: CERN DEM JLC; CreateDate: 03.12.2007; LatestRevisionDate: 17.10.2012
R257 = R0402_0R_JUMPER: Resistor; Part Description: 1A (0.05R Max DC Resistance) Zero Ohm Jumper; Manufacturer: GENERIC; Manufacturer1 Part Number: 232270591001L; Part Number: R0402_0R_JUMPER; Component Kind: Standard; Component Type: Standard; Pin Count: 2; Value: 0; Status: Not recommended; Manufacturer Part Number: R0402_0R_JUMPER; Case: 0402; Mounted: Yes; Sense: No; Socket: No; SMD: Yes; Manufacturer1 Example: YAGEO PHYCOMP; Manufacturer1 ComponentHeight: 0.4mm; HelpURL: \\cern.ch\dfs\Applications\Altium\Datasheets\R0402_Phycomp_RC0402.pdf; Author: CERN DEM JLC; CreateDate: 2007-12-03; LatestRevisionDate: 2012-10-17
R309 R310 = R0805_10M_1%_0.125W_100PPM_VISHAY_CRCW e3: Resistor - 1%; Part Description: 150V, Standard Thick Film Chip Resistor; Manufacturer: VISHAY DALE; Manufacturer Part Number: CRCW080510M0FKEA; Power: 0.125W; TC: ±100ppm/°C; PressFit: No; Part Number: R0805_10M_1%_0.125W_100PPM_VISHAY_CRCW e3; Component Kind: Standard; Component Type: Standard; Pin Count: 2; Value: 10M; Status: None; Tolerance: ±1%; Case: 0805; Mounted: Yes; Sense: No; Socket: No; SMD: Yes; ComponentHeight: 0.5mm; HelpURL: \\cern.ch\dfs\Applications\Altium\Datasheets\R0805_VISHAY_CRCW e3.pdf; Author: CERN DEM BC; CreateDate: 2019-11-12; LatestRevisionDate: 2019-11-12
T2 T13 = BSS138LT1G: N-CHANNEL MOSFET WITH DIODE; Part Description: 50V 200mA N-Channel Enhancement Mode Field-Effect Transistor; Manufacturer: ON SEMICONDUCTOR; PressFit: No; Bonding: No; Part Number: BSS138LT1G; Component Kind: Standard; Component Type: Standard; Device: BSS138LT1G; PackageDescription: SOT23 3-Leads, Pitch 0.95mm - Body 1.4x3mm, IPC Medium Density; Manufacturer Part Number: BSS138LT1G; Pin Count: 3; Case: SOT23-3; Mounted: Yes; Socket: No; SMD: Yes; Sense: No; ComponentHeight: 1.11mm; HelpURL: \\cern.ch\dfs\Applications\Altium\Datasheets\BSS138LT1G.pdf; Author: CERN DEM JLC; CreateDate: 23.03.2009; LatestRevisionDate: 23.03.2009
WASHER1-WASHER10 = Keystone_7687: SMA_Shoulder Washer; Part Number: custom 3D; Part Description: Polyphenylene Sulfide PPS Shoulder Washer; PressFit: No; Component Kind: Standard; Component Type: Mechanical; Footprint: custom 3D; Pin Count: 0; PackageDescription: Polyphenylene Sulfide PPS Shoulder Washer; Mounted: Yes; Socket: No; SMD: No; Sense: No; Status: None; Value: D11.1xd6.6; Manufacturer: custom 3D; Manufacturer Part Number: custom 3D; ComponentHeight: 1.91mm; HelpURL: \\cern.ch\dfs\Applications\Altium\Datasheets\AAVID-THERMALLOY_7721-7PPSG.pdf; Author: GK; CreateDate: 28.01.2016; LatestRevisionDate: 28.01.2016

## Sheet Attenuator.SchDoc: =P_Title
size 420 x 297 mm; EDA_Number: ARTIQ; Projet: ARTIQ/SINARA; Author: G.Kasprowicz; CompanyName: WUT ISE; DrawnBy: G.Kasprowicz; Organization: WUT ISE; Address1: PW ISE; Address2: Nowowiejska 15/19 00-665 Warsaw; Address3: gkasprow@gmail.com; DocumentNumber: 10; Revision: 2; SheetNumber: 10; SheetTotal: 19; ModifiedBy: -; CheckedDate: -; Title2: Attenuator; DivGrp: WUT ISE; Designer: G.Kasprowicz; ModifiedDate: -; ProjectName: Sensor Box
Used 2 times, as channels Attenuator0, Attenuator1. Parts and nets are listed once, with the designators drawn on the sheet.
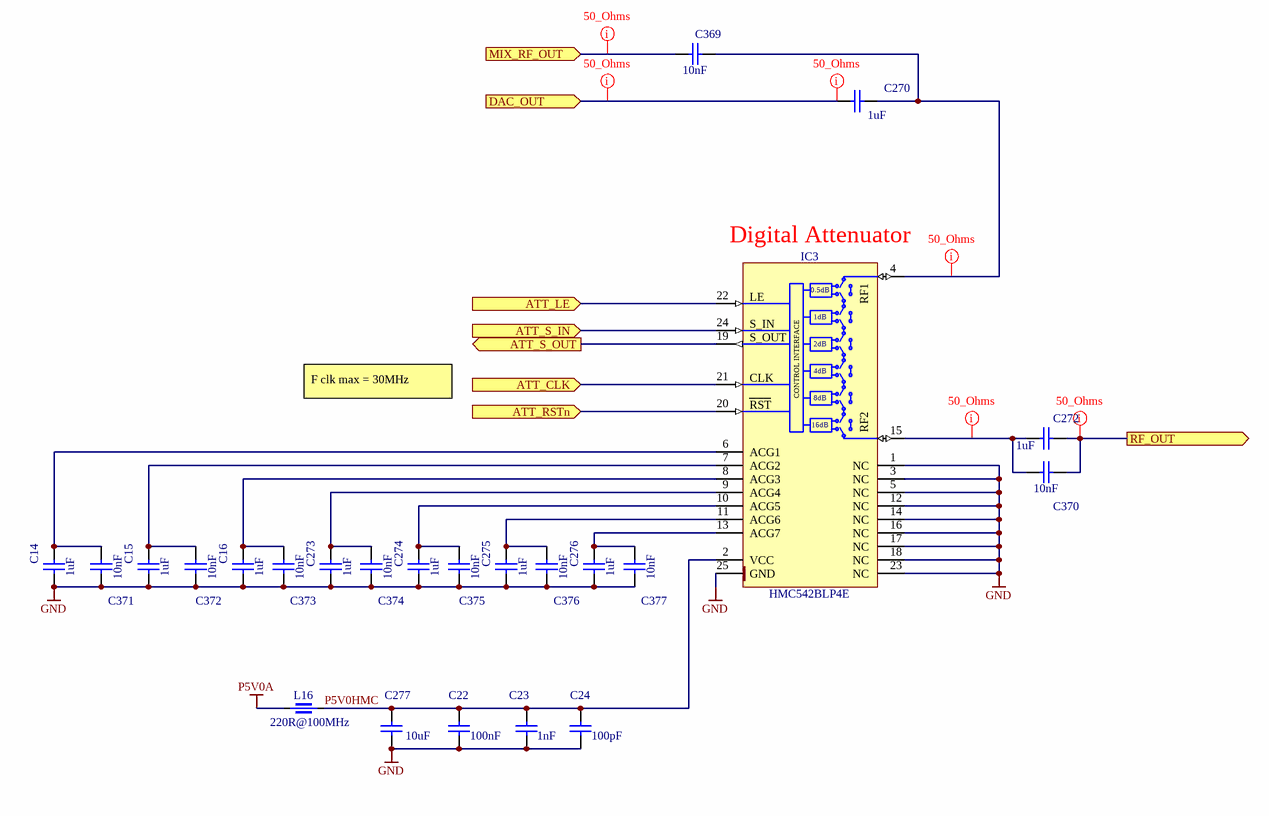
[diagram p1: Attenuator.SchDoc]

### Parts
C14  1uF  [CAPC1005X55N]
C15  1uF  [CAPC1005X55N]
C16  1uF  [CAPC1005X55N]
C22  100nF  [CAPC1005X55N]
C23  1nF  [CAPC1005X55N]
C24  100pF  [CAPC1005X55N]
C270  1uF  [CAPC1005X55N]
C272  1uF  [CAPC1005X55N]
C273  1uF  [CAPC1005X55N]
C274  1uF  [CAPC1005X55N]
C275  1uF  [CAPC1005X55N]
C276  1uF  [CAPC1005X55N]
C277  10uF  [CAPC1608X80N]
C369  10nF  [CAPC1005X55N]
C370  10nF  [CAPC1005X55N]
C371  10nF  [CAPC1005X55N]
C372  10nF  [CAPC1005X55N]
C373  10nF  [CAPC1005X55N]
C374  10nF  [CAPC1005X55N]
C375  10nF  [CAPC1005X55N]
C376  10nF  [CAPC1005X55N]
C377  10nF  [CAPC1005X55N]
IC3  HMC542BLP4E  [QFN50P400X400X100-25N-S295]
L16  220R@100MHz  [INDC1608X95N]

### Ports
ATT_CLK (in), ATT_LE (in), ATT_RSTn (in), ATT_S_IN (in), ATT_S_OUT (out), DAC_OUT (in), MIX_RF_OUT (in), RF_OUT (out)

### Nets
GND: C14.1 C15.1 C16.1 C22.1 C23.1 C24.1 C273.1 C274.1 C275.1 C276.1 C277.1 C371.1 C372.1 C373.1 C374.1 C375.1 C376.1 C377.1 IC3.1(NC) IC3.3(NC) IC3.5(NC) IC3.12(NC) IC3.14(NC) IC3.16(NC) IC3.17(NC) IC3.18(NC) IC3.23(NC) IC3.25(GND)
P5V0A: L16.1
ATT_CLK: IC3.21(SHIFT_CLOCK) ; port ATT_CLK
ATT_LE: IC3.22(LATCH_ENABLE) ; port ATT_LE
ATT_RSTn: IC3.20(~{RESET}) ; port ATT_RSTn
ATT_S_IN: IC3.24(SERIAL_INPUT) ; port ATT_S_IN
ATT_S_OUT: IC3.19(SERIAL_OUTPUT) ; port ATT_S_OUT
DAC_OUT: C270.2 ; port DAC_OUT
MIX_RF_OUT: C369.1 ; port MIX_RF_OUT
P5V0HMC: C22.2 C23.2 C24.2 C277.2 IC3.2(VCC) L16.2
RF_OUT: C272.1 C370.2 ; port RF_OUT
NetC14_2: C14.2 C371.2 IC3.6(ACG1)
NetC15_2: C15.2 C372.2 IC3.7(ACG2)
NetC16_2: C16.2 C373.2 IC3.8(ACG3)
NetC270_1: C270.1 C369.2 IC3.4(RF1)
NetC272_2: C272.2 C370.1 IC3.15(RF2)
NetC273_2: C273.2 C374.2 IC3.9(ACG4)
NetC274_2: C274.2 C375.2 IC3.10(ACG5)
NetC275_2: C275.2 C376.2 IC3.11(ACG6)
NetC276_2: C276.2 C377.2 IC3.13(ACG7)

### Channels
Attenuator0: designators end in A; ports ATT_CLK=ATT_CLK0 ATT_LE=ATT_LE0 ATT_RSTn=ATT_RST0n ATT_S_IN=ATT_S_IN0 ATT_S_OUT=NetIC3A_19 DAC_OUT=NetC270A_2 MIX_RF_OUT=NetC369A_1 RF_OUT=RF_OUT0
Attenuator1: designators end in B; ports ATT_CLK=ATT_CLK1 ATT_LE=ATT_LE1 ATT_RSTn=ATT_RST1n ATT_S_IN=ATT_S_IN1 ATT_S_OUT=NetIC3B_19 DAC_OUT=NetC270B_2 MIX_RF_OUT=NetC369B_1 RF_OUT=RF_OUT1

### Layout directives
net class 50_Ohms: NetC270A_1, NetC270A_2, NetC272A_2, NetC369A_1, RF_OUT0

### Notes on the sheet
- (near IC3) Digital Attenuator
- F clk max = 30MHz
- Project/Equipment
- Document
- Designer
- Drawn by
- Check.by
- Copyright WUT ISE 2018.
  This documentation describes Open Hardware and is licensed under the CERN OHL v.1.1. You may redistribute and modify this documentation under the terms of the CERN OHL v.1.1. (http://ohwr.org/CERNOHL). This documentation is distributed WITHOUT ANY EXPRESS OR IMPLIED WARRANTY, INCLUDING OF MERCHANTABILITY, SATISFACTORY QUALITY AND FITNESS FOR A PARTICULAR PURPOSE. Please see the CERN OHL v.1.1 for applicable conditions.
- Contact
- File
- Last Mod.
- Print Date
- Sheet
- Size
- A3
- of
- Rev
- (in symbol HMC542BLP4E) 0.5dB; LE; 1dB; S_IN; S_OUT; 2dB; CONTROL INTERFACE; 4dB; CLK; 8dB; RST; 16dB

### Library data of the parts
C14-C16 C270 C272-C276 = CC0402_1UF_16V_10%_X5R: Non-polarised capacitor; Part Description: SMD Multilayer Chip Ceramic Capacitor; Manufacturer: GENERIC; Manufacturer1 Part Number: C1005X5R1C105KT; Voltage: 16V; TC: X5R; Tolerance: ±10%; Part Number: CC0402_1UF_16V_10%_X5R; Component Kind: Standard; Component Type: Standard; Pin Count: 2; Value: 1uF; Status: Preferred; Manufacturer Part Number: CC0402_1UF_16V_10%_X5R; Case: 0402; Mounted: Yes; Socket: No; SMD: Yes; Sense: No; Manufacturer1 Example: TDK; Manufacturer1 ComponentHeight: 0.55mm; HelpURL: \\cern.ch\dfs\Applications\Altium\Datasheets\CC0402_X5R_TDK_C.pdf; Author: CERN DEM JLC; CreateDate: 25.10.2012; LatestRevisionDate: 25.10.2012
C22 = CC0402_100NF_16V_10%_X7R: Non-polarised capacitor; Part Description: SMD Multilayer Chip Ceramic Capacitor; Manufacturer: GENERIC; Manufacturer1 Part Number: GRM155R71C104KA88D; Voltage: 16V; TC: X7R; Tolerance: ±10%; Part Number: CC0402_100NF_16V_10%_X7R; Component Kind: Standard; Component Type: Standard; Pin Count: 2; Value: 100nF; Status: Not Recommended; Manufacturer Part Number: CC0402_100NF_16V_10%_X7R; Case: 0402; Mounted: Yes; Socket: No; SMD: Yes; Sense: No; Manufacturer1 Example: MURATA; Manufacturer1 ComponentHeight: 0.55mm; HelpURL: \\cern.ch\dfs\Applications\Altium\Datasheets\CC0402_X7R_MURATA_GRM.pdf; Author: CERN DEM JLC; CreateDate: 2013-12-05; LatestRevisionDate: 2007-12-03
C23 = CC0402_1NF_50V_10%_X7R: Non-polarised capacitor; Part Description: SMD Multilayer Chip Ceramic Capacitor; Manufacturer: GENERIC; Manufacturer1 Part Number: 223858715623; Voltage: 50V; TC: X7R; Tolerance: ±10%; Part Number: CC0402_1NF_50V_10%_X7R; Component Kind: Standard; Component Type: Standard; Pin Count: 2; Value: 1nF; Status: Not Recommended; Manufacturer Part Number: CC0402_1NF_50V_10%_X7R; Case: 0402; Mounted: Yes; Socket: No; SMD: Yes; Sense: No; Manufacturer1 Example: PHYCOMP; Manufacturer1 ComponentHeight: 0.55mm; HelpURL: \\cern.ch\dfs\Applications\Altium\Datasheets\CC0402_X7R_PHYCOMP.pdf; Author: CERN DEM JLC; CreateDate: 2007-12-03; LatestRevisionDate: 2007-12-03
C24 = CC0402_100PF_50V_5%_C0G: Non-polarised capacitor; Part Description: SMD Multilayer Chip Ceramic Capacitor; Manufacturer: GENERIC; Manufacturer1 Part Number: C0402C101J5GACTU; Voltage: 50V; TC: C0G/NP0; Tolerance: ±5%; Part Number: CC0402_100PF_50V_5%_C0G; Component Kind: Standard; Component Type: Standard; Pin Count: 2; Value: 100pF; Status: Preferred; Manufacturer Part Number: CC0402_100PF_50V_5%_C0G; Case: 0402; Mounted: Yes; Socket: No; SMD: Yes; Sense: No; Manufacturer1 Example: KEMET; Manufacturer1 ComponentHeight: 0.55mm; HelpURL: \\cern.ch\dfs\Applications\Altium\Datasheets\CC0805_C0G_KEMET_(Commercial Grade).pdf; Author: CERN DEM JLC; CreateDate: 2007-12-03; LatestRevisionDate: 2015-04-22
C277 = CC0603_10UF_16V_20%_X5R: Non-polarised capacitor; Part Description: SMD Multilayer Chip Ceramic Capacitor; Manufacturer: GENERIC; Manufacturer1 Part Number: GRM188R61C106MA73D; Voltage: 16V; TC: X5R; Tolerance: ±20%; Part Number: CC0603_10UF_16V_20%_X5R; Component Kind: Standard; Component Type: Standard; Pin Count: 2; Value: 10uF; Status: None; Manufacturer Part Number: CC0603_10UF_16V_20%_X5R; Case: 0603; Mounted: Yes; Socket: No; SMD: Yes; Sense: No; Manufacturer1 Example: MURATA; Manufacturer1 ComponentHeight: 0.8mm; HelpURL: \\cern.ch\dfs\Applications\Altium\Datasheets\CC0603_X5R_MURATA_GRM.pdf; Author: CERN DEM MR; CreateDate: 2016-03-02; LatestRevisionDate: 2016-03-02
C369-C377 = CC0402_10NF_25V_10%_X7R: Non-polarised capacitor; Part Description: SMD Multilayer Chip Ceramic Capacitor; Manufacturer: GENERIC; Manufacturer1 Part Number: C1005X7R1E103KT; Voltage: 25V; TC: X7R; Tolerance: ±10%; Part Number: CC0402_10NF_25V_10%_X7R; Component Kind: Standard; Component Type: Standard; Pin Count: 2; Value: 10nF; Status: Preferred; Manufacturer Part Number: CC0402_10NF_25V_10%_X7R; Case: 0402; Mounted: Yes; Socket: No; SMD: Yes; Sense: No; Manufacturer1 Example: TDK; Manufacturer1 ComponentHeight: 0.55mm; HelpURL: \\cern.ch\dfs\Applications\Altium\Datasheets\CC0402_X7R_TDK_C.pdf; Author: CERN DEM JLC; CreateDate: 25.10.2012; LatestRevisionDate: 25.10.2012
IC3 = HMC542BLP4E: 0.5dB LSB GaAs MMIC 6-bit Digital Serial Control Attenuator, DC - 4GHz; Part Description: 0.5dB LSB GaAs MMIC 6-bit Digital Serial Control Attenuator, DC to 4GHz; Manufacturer: HITTITE MICROWAVE CORP; PressFit: No; Bonding: No; Part Number: HMC542BLP4E; Component Kind: Standard; Component Type: Standard; Device: HMC542BLP4E; PackageDescription: QFN, 0.50mm Pitch, Square; 24 Pin, 4.00mm L X 4.00mm W X 1.00mm H Body (w/thermal Tab 2.95 X 2.95mm), IPC Medium Density; Manufacturer Part Number: HMC542BLP4E; Pin Count: 25; Case: QFN24; Mounted: Yes; Socket: No; SMD: Yes; Sense: No; ComponentHeight: 1mm; Author: CERN DEM JMW; HelpURL: \\cern.ch\dfs\Applications\Altium\Datasheets\HMC542BLP4E.pdf; CreateDate: 2016-08-17; LatestRevisionDate: 2016-08-17
L16 = IND0603_MURATA_BLM18SG221TN1: Part Description: SMD EMIFIL Suppression Chip Ferrite Bead; Manufacturer: MURATA; Power: 2.5A; Resistance: 0.04R; Tolerance: ±25%; Part Number: IND0603_MURATA_BLM18SG221TN1; Component Kind: Standard; Component Type: Standard; Pin Count: 2; Value: 220R@100MHz; Status: None; Manufacturer Part Number: BLM18SG221TN1; Case: 0603; Mounted: Yes; Socket: No; SMD: Yes; Sense: No; ComponentHeight: 0.95mm; HelpURL: \\cern.ch\dfs\Applications\Altium\Datasheets\IND0603_MURATA_BLM18S.pdf; Author: CERN DEM MR; CreateDate: 08.01.2016; LatestRevisionDate: 25.10.2018

## Sheet FPGA_MISC.SchDoc: =P_Title
size 420 x 297 mm; EDA_Number: ARTIQ; Projet: ARTIQ/SINARA; Author: G.Kasprowicz; CompanyName: WUT ISE; DrawnBy: G.Kasprowicz; Organization: WUT ISE; Address1: PW ISE; Address2: Nowowiejska 15/19 00-665 Warsaw; Address3: gkasprow@gmail.com; DocumentNumber: 18; Revision: 2; SheetNumber: 18; SheetTotal: 19; ModifiedBy: -; CheckedDate: -; Title2: FPGA MISC; DivGrp: WUT ISE; Designer: G.Kasprowicz; ModifiedDate: -; ProjectName: Sensor Box
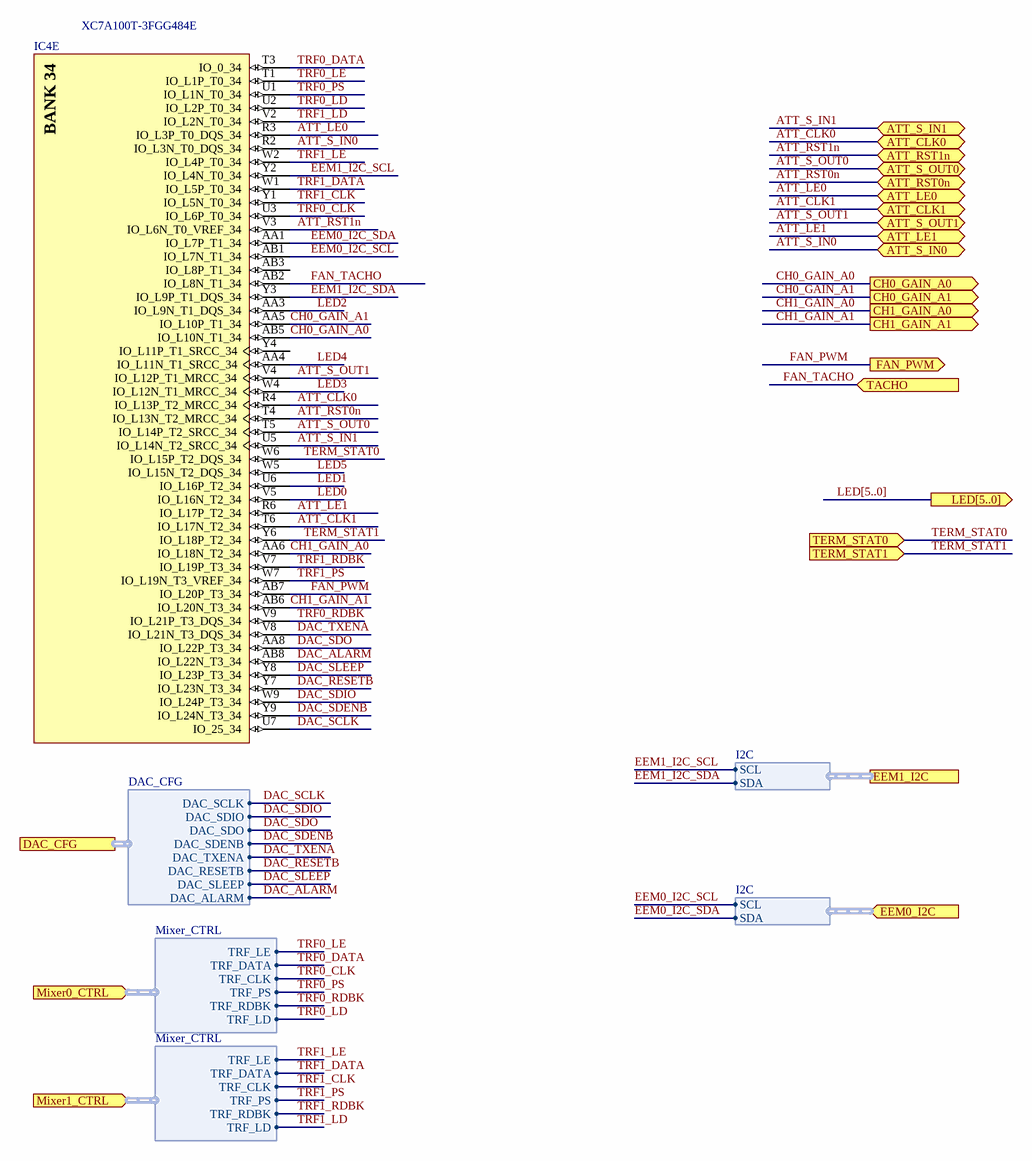
[diagram p2: FPGA_MISC.SchDoc]

### Parts
(Parts that share a designator on the sheet are numbered #1, #2 ... from top to bottom, then left to right.)
IC4#1  XC7A100T-3FGG484E  [FGG484]  (part E of 10)

### Ports
ATT_CLK0 (bidir), ATT_CLK1 (bidir), ATT_LE0 (bidir), ATT_LE1 (bidir), ATT_RST0n (bidir), ATT_RST1n (bidir), ATT_S_IN0 (bidir), ATT_S_IN1 (bidir), ATT_S_OUT0 (bidir), ATT_S_OUT1 (bidir), CH0_GAIN_A0 (out), CH0_GAIN_A1 (out), CH1_GAIN_A0 (out), CH1_GAIN_A1 (out), DAC_CFG (harness DAC_CFG), EEM0_I2C (in, harness I2C), EEM1_I2C (harness I2C), FAN_PWM (out), LED[5..0] (out), Mixer0_CTRL (in, harness Mixer_CTRL), Mixer1_CTRL (in, harness Mixer_CTRL), TACHO (in), TERM_STAT0 (in), TERM_STAT1 (in)

### Harnesses
I2C: SDA, SCL
DAC_CFG: DAC_SCLK, DAC_SDIO, DAC_SDO, DAC_SDENB, DAC_TXENA, DAC_RESETB, DAC_SLEEP, DAC_ALARM
Mixer_CTRL: TRF_LE, TRF_DATA, TRF_CLK, TRF_PS, TRF_RDBK, TRF_LD

### Nets
ATT_CLK0: IC4#1.R4(IO_L13P_T2_MRCC_34) ; port ATT_CLK0
ATT_CLK1: IC4#1.T6(IO_L17N_T2_34) ; port ATT_CLK1
ATT_LE0: IC4#1.R3(IO_L3P_T0_DQS_34) ; port ATT_LE0
ATT_LE1: IC4#1.R6(IO_L17P_T2_34) ; port ATT_LE1
ATT_RST0n: IC4#1.T4(IO_L13N_T2_MRCC_34) ; port ATT_RST0n
ATT_RST1n: IC4#1.V3(IO_L6N_T0_VREF_34) ; port ATT_RST1n
ATT_S_IN0: IC4#1.R2(IO_L3N_T0_DQS_34) ; port ATT_S_IN0
ATT_S_IN1: IC4#1.U5(IO_L14N_T2_SRCC_34) ; port ATT_S_IN1
ATT_S_OUT0: IC4#1.T5(IO_L14P_T2_SRCC_34) ; port ATT_S_OUT0
ATT_S_OUT1: IC4#1.V4(IO_L12P_T1_MRCC_34) ; port ATT_S_OUT1
CH0_GAIN_A0: IC4#1.AB5(IO_L10N_T1_34) ; port CH0_GAIN_A0
CH0_GAIN_A1: IC4#1.AA5(IO_L10P_T1_34) ; port CH0_GAIN_A1
CH1_GAIN_A0: IC4#1.AA6(IO_L18N_T2_34) ; port CH1_GAIN_A0
CH1_GAIN_A1: IC4#1.AB6(IO_L20N_T3_34) ; port CH1_GAIN_A1
DAC_ALARM: IC4#1.AB8(IO_L22N_T3_34) ; port DAC_CFG.DAC_ALARM
DAC_RESETB: IC4#1.Y7(IO_L23N_T3_34) ; port DAC_CFG.DAC_RESETB
DAC_SCLK: IC4#1.U7(IO_25_34) ; port DAC_CFG.DAC_SCLK
DAC_SDENB: IC4#1.Y9(IO_L24N_T3_34) ; port DAC_CFG.DAC_SDENB
DAC_SDIO: IC4#1.W9(IO_L24P_T3_34) ; port DAC_CFG.DAC_SDIO
DAC_SDO: IC4#1.AA8(IO_L22P_T3_34) ; port DAC_CFG.DAC_SDO
DAC_SLEEP: IC4#1.Y8(IO_L23P_T3_34) ; port DAC_CFG.DAC_SLEEP
DAC_TXENA: IC4#1.V8(IO_L21N_T3_DQS_34) ; port DAC_CFG.DAC_TXENA
EEM0_I2C_SCL: IC4#1.AB1(IO_L7N_T1_34) ; port EEM0_I2C.SCL
EEM0_I2C_SDA: IC4#1.AA1(IO_L7P_T1_34) ; port EEM0_I2C.SDA
EEM1_I2C_SCL: IC4#1.Y2(IO_L4N_T0_34) ; port EEM1_I2C.SCL
EEM1_I2C_SDA: IC4#1.Y3(IO_L9P_T1_DQS_34) ; port EEM1_I2C.SDA
FAN_PWM: IC4#1.AB7(IO_L20P_T3_34) ; port FAN_PWM
FAN_TACHO: IC4#1.AB2(IO_L8N_T1_34) ; port TACHO
LED0: IC4#1.V5(IO_L16N_T2_34)
LED1: IC4#1.U6(IO_L16P_T2_34)
LED2: IC4#1.AA3(IO_L9N_T1_DQS_34)
LED3: IC4#1.W4(IO_L12N_T1_MRCC_34)
LED4: IC4#1.AA4(IO_L11N_T1_SRCC_34)
LED5: IC4#1.W5(IO_L15N_T2_DQS_34)
TERM_STAT0: IC4#1.W6(IO_L15P_T2_DQS_34) ; port TERM_STAT0
TERM_STAT1: IC4#1.Y6(IO_L18P_T2_34) ; port TERM_STAT1
TRF0_CLK: IC4#1.U3(IO_L6P_T0_34) ; port Mixer0_CTRL.TRF_CLK
TRF0_DATA: IC4#1.T3(IO_0_34) ; port Mixer0_CTRL.TRF_DATA
TRF0_LD: IC4#1.U2(IO_L2P_T0_34) ; port Mixer0_CTRL.TRF_LD
TRF0_LE: IC4#1.T1(IO_L1P_T0_34) ; port Mixer0_CTRL.TRF_LE
TRF0_PS: IC4#1.U1(IO_L1N_T0_34) ; port Mixer0_CTRL.TRF_PS
TRF0_RDBK: IC4#1.V9(IO_L21P_T3_DQS_34) ; port Mixer0_CTRL.TRF_RDBK
TRF1_CLK: IC4#1.Y1(IO_L5N_T0_34) ; port Mixer1_CTRL.TRF_CLK
TRF1_DATA: IC4#1.W1(IO_L5P_T0_34) ; port Mixer1_CTRL.TRF_DATA
TRF1_LD: IC4#1.V2(IO_L2N_T0_34) ; port Mixer1_CTRL.TRF_LD
TRF1_LE: IC4#1.W2(IO_L4P_T0_34) ; port Mixer1_CTRL.TRF_LE
TRF1_PS: IC4#1.W7(IO_L19N_T3_VREF_34) ; port Mixer1_CTRL.TRF_PS
TRF1_RDBK: IC4#1.V7(IO_L19P_T3_34) ; port Mixer1_CTRL.TRF_RDBK

Not connected (* = marked no-connect by the designer): IC4#1 AB3(IO_L8P_T1_34) Y4(IO_L11P_T1_SRCC_34)

### Buses and harness runs
bus LED[5..0] = port LED[5..0]

### Notes on the sheet
- Project/Equipment
- Document
- Designer
- Drawn by
- Check.by
- Copyright WUT ISE 2018.
  This documentation describes Open Hardware and is licensed under the CERN OHL v.1.1. You may redistribute and modify this documentation under the terms of the CERN OHL v.1.1. (http://ohwr.org/CERNOHL). This documentation is distributed WITHOUT ANY EXPRESS OR IMPLIED WARRANTY, INCLUDING OF MERCHANTABILITY, SATISFACTORY QUALITY AND FITNESS FOR A PARTICULAR PURPOSE. Please see the CERN OHL v.1.1 for applicable conditions.
- Contact
- File
- Last Mod.
- Print Date
- Sheet
- Size
- A3
- of
- Rev
- (in symbol CMP-0364-00028-3, part E) BANK 34

### Library data of the parts
IC4#1 = CMP-0364-00028-3: Artix-7 FPGA, 285 User I/Os, 4 GTP, 484-Ball BGA, Speed Grade 3, Extended Grade, Pb-Free; Manufacturer: Xilinx; Max User I/O: 300; Clock Mgmt Tiles (CMTs): 6; Logic Cells: 101440; Block RAM Blocks (36Kb): 135; Block RAM Blocks (18Kb): 270; Speed Grade: -3; CLBs (Slices): 15850; Block RAM Blocks (Max Kb): 4860; DSP48E1 Slices: 240; RoHS: Pb-Free; ComponentLink3URL: http://www.xilinx.com/support/documentation/data_sheets/ds181_Artix_7_Data_Sheet.pdf; NexusDeviceID: XC7A100T-3FGG484E; DatasheetVersion: v1.12; Mounting Technology: Surface Mount; PackageDescription: Wire-Bond Fine-Pitch BGA, Body 23 x 23 mm, 1.0 mm Pitch; PackageReference: FGG484; ComponentLink2Description: Package Specification; Code_JEDEC: MS-034-AAJ-1; ComponentLink2URL: http://www.xilinx.com/support/documentation/user_guides/ug475_7Series_Pkg_Pinout.pdf; ComponentLink3Description: DC and Switching Characteristics; Generic Part Number: XC7A100T; ComponentLink4Description: Package File; ComponentLink4URL: http://www.xilinx.com/support/packagefiles/a7packages/xc7a100tfgg484pkg.txt; ComponentLink1URL: http://www.xilinx.com/support/documentation/data_sheets/ds180_7Series_Overview.pdf; PartNumber: XC7A100T-3FGG484E; ComponentLink5URL: http://www.xilinx.com/support/documentation/user_guides/ug475_7Series_Pkg_Pinout.pdf; PackageVersion: Rev 1.8; ComponentLink5Description: Packaging and Pinout; ComponentLink1Description: Datasheet; CLBs (Max Distributed RAM Kb): 1188